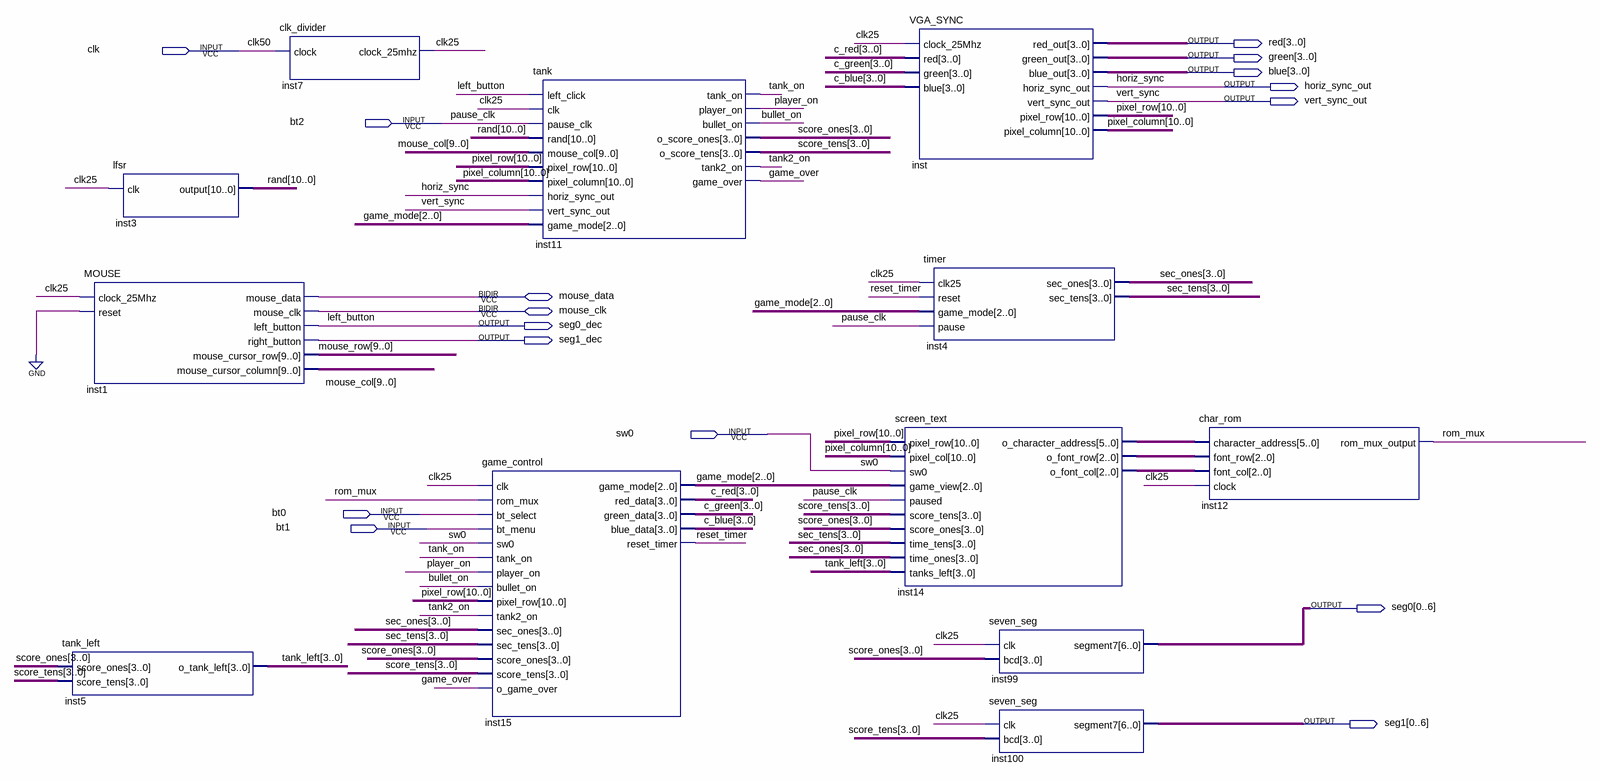
[diagram p0: schematic sheet]
// Quartus schematic mini_project_group09.bdf as structural Verilog: 12 symbols, 16 pins
module mini_project_group09 (
  input  clk,
  input  bt2,
  input  sw0,
  input  bt0,
  input  bt1,
  inout  mouse_data,
  inout  mouse_clk,
  output [3:0] red,
  output [3:0] green,
  output [3:0] blue,
  output horiz_sync_out,
  output vert_sync_out,
  output seg0_dec,
  output seg1_dec,
  output [0:6] seg0,
  output [0:6] seg1
);

  wire bullet_on, clk25, game_over, player_on, reset_timer, rom_mux, tank2_on, tank_on;
  wire [2:0] game_mode, inst14_o_font_col, inst14_o_font_row;
  wire [3:0] c_blue, c_green, c_red, score_ones, score_tens, sec_ones, sec_tens, tank_left;
  wire [5:0] inst14_o_character_address;
  wire [9:0] mouse_col, mouse_row;
  wire [10:0] pixel_column, pixel_row, \rand ;

  tank_left inst5 (.score_ones(score_ones), .score_tens(score_tens), .o_tank_left(tank_left));
  lfsr inst3 (.clk(clk25), .\output (\rand ));
  MOUSE inst1 (
    .clock_25Mhz(clk25), .reset(1'b0), .left_button(seg0_dec), .right_button(seg1_dec),
    .mouse_cursor_row(mouse_row), .mouse_cursor_column(mouse_col), .mouse_data(mouse_data),
    .mouse_clk(mouse_clk));
  clk_divider inst7 (.clock(clk), .clock_25mhz(clk25));
  game_control inst15 (
    .clk(clk25), .rom_mux(rom_mux), .bt_select(bt0), .bt_menu(bt1), .sw0(sw0), .tank_on(tank_on),
    .player_on(player_on), .bullet_on(bullet_on), .pixel_row(pixel_row), .tank2_on(tank2_on),
    .sec_ones(sec_ones), .sec_tens(sec_tens), .score_ones(score_ones), .score_tens(score_tens),
    .o_game_over(game_over), .game_mode(game_mode), .red_data(c_red), .green_data(c_green),
    .blue_data(c_blue), .reset_timer(reset_timer));
  tank inst11 (
    .left_click(seg0_dec), .clk(clk25), .pause_clk(bt2), .\rand (\rand ), .mouse_col(mouse_col),
    .pixel_row(pixel_row), .pixel_column(pixel_column), .horiz_sync_out(horiz_sync_out),
    .vert_sync_out(vert_sync_out), .game_mode(game_mode), .tank_on(tank_on), .player_on(player_on),
    .bullet_on(bullet_on), .o_score_ones(score_ones), .o_score_tens(score_tens), .tank2_on(tank2_on),
    .game_over(game_over));
  VGA_SYNC inst (
    .clock_25Mhz(clk25), .red(c_red), .green(c_green), .blue(c_blue), .red_out(red), .green_out(green),
    .blue_out(blue), .horiz_sync_out(horiz_sync_out), .vert_sync_out(vert_sync_out), .pixel_row(pixel_row),
    .pixel_column(pixel_column));
  timer inst4 (
    .clk25(clk25), .reset(reset_timer), .game_mode(game_mode), .pause(bt2), .sec_ones(sec_ones),
    .sec_tens(sec_tens));
  screen_text inst14 (
    .pixel_row(pixel_row), .pixel_col(pixel_column), .sw0(sw0), .game_view(game_mode), .paused(bt2),
    .score_tens(score_tens), .score_ones(score_ones), .time_tens(sec_tens), .time_ones(sec_ones),
    .tanks_left(tank_left), .o_character_address(inst14_o_character_address), .o_font_row(inst14_o_font_row),
    .o_font_col(inst14_o_font_col));
  seven_seg inst99 (.clk(clk25), .bcd(score_ones), .segment7(seg0));
  seven_seg inst100 (.clk(clk25), .bcd(score_tens), .segment7(seg1));
  char_rom inst12 (
    .character_address(inst14_o_character_address), .font_row(inst14_o_font_row),
    .font_col(inst14_o_font_col), .clock(clk25), .rom_mux_output(rom_mux));

  // Other names for the same wires on the sheet: clk50 = clk; horiz_sync = horiz_sync_out; left_button = seg0_dec;
  //   pause_clk = bt2; vert_sync = vert_sync_out
endmodule
